# EAGLE design PlugEVSE_2x20A (EAGLE 8.6.0)
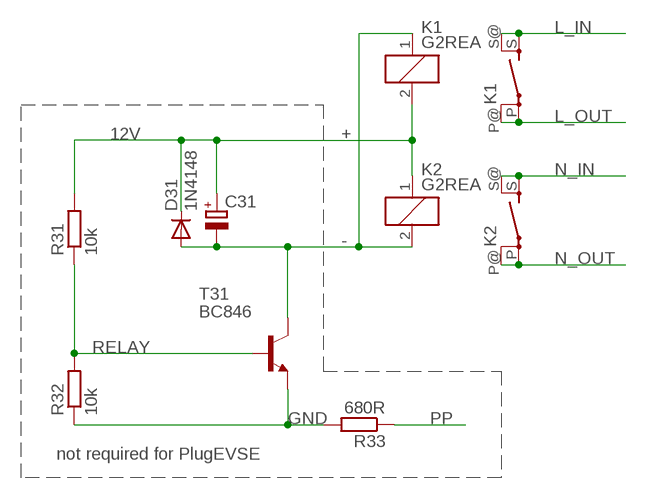
[diagram p0: schematic, sheet 1]

## Parts
C31  CPOL-EUSMCC  [SMC_C]
D31  1N4148  DIODE-SOD123  [SOD123]
K1  G2REA  [G2REA]
K2  G2REA  [G2REA]
R31  10k  R-EU_R0603  [R0603]
R32  10k  R-EU_R0603  [R0603]
R33  680R  R-EU_R2512  [R2512]
T31  BC846  [SOT23]

## Nets
12V: C31.+ D31.C K1.2 K2.1 R31.2
GND: R32.1 R33.2 T31.2(E)
L_IN: K1.S(2:S) K1.S@(2:S)
L_OUT: K1.P(2:P) K1.P@(2:P)
N_IN: K2.S(2:S) K2.S@(2:S)
N_OUT: K2.P(2:P) K2.P@(2:P)
PP: R33.1
RELAY: R31.1 R32.2 T31.1(B)
RL: C31.- D31.A K1.1 K2.2 T31.3(C)

## Notes on the sheet
- +
- -
- not required for PlugEVSE

## Library data of the parts
C31 = rcl:CPOL-EU: POLARIZED CAPACITOR, European symbol; SPICEPREFIX: C
D31 = diode:DIODE-: DIODE
K1 K2 = relay:G2REA: RELAY 1 x norm. open, high current, Omron; OC_FARNELL: unknown; OC_NEWARK: unknown
R31 R32 = rcl:R-EU_: RESISTOR, European symbol; SPICEPREFIX: R
R33 = rcl:R-EU_: RESISTOR, European symbol
T31 = transistor:BC846: NPN TRANSISTOR

## Board
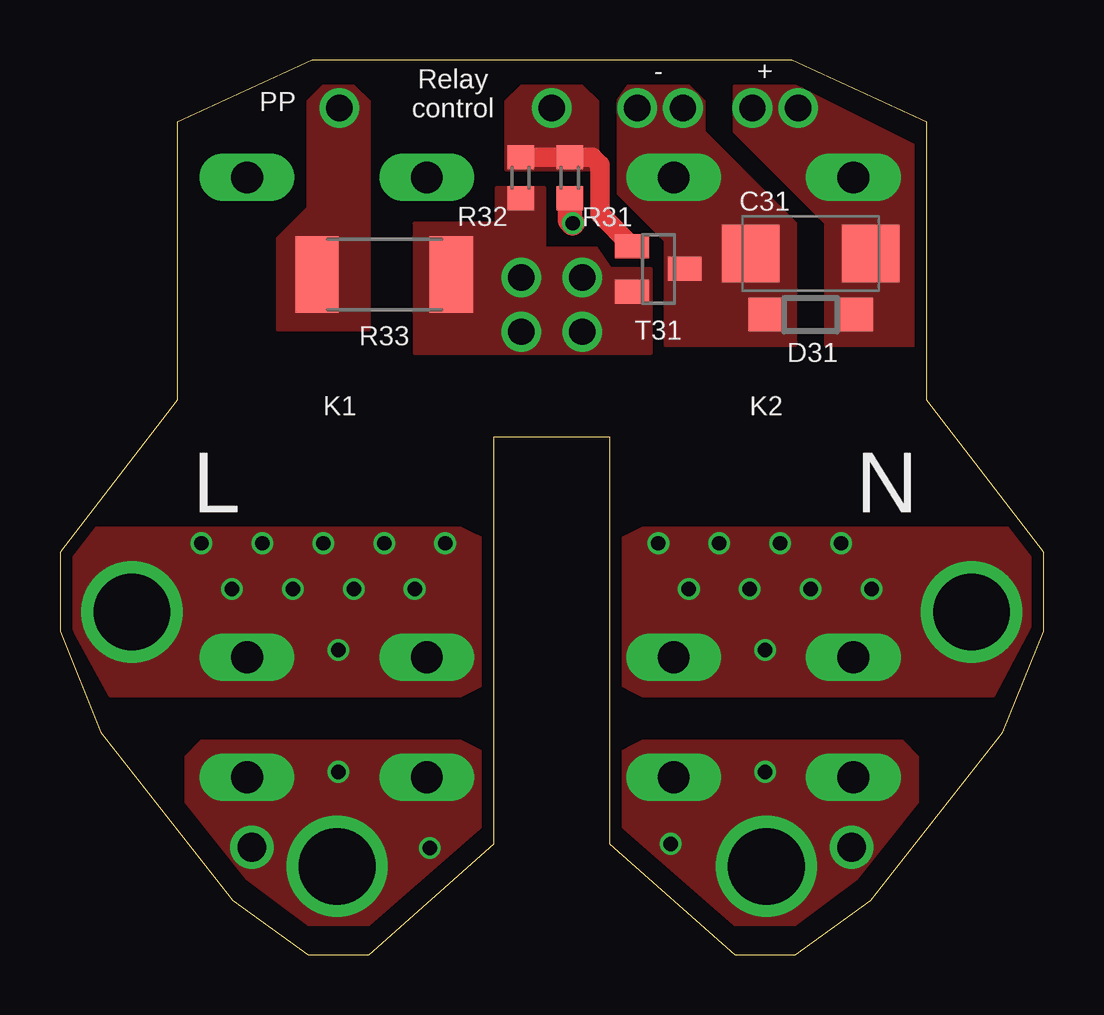
[diagram p1: board, top side]
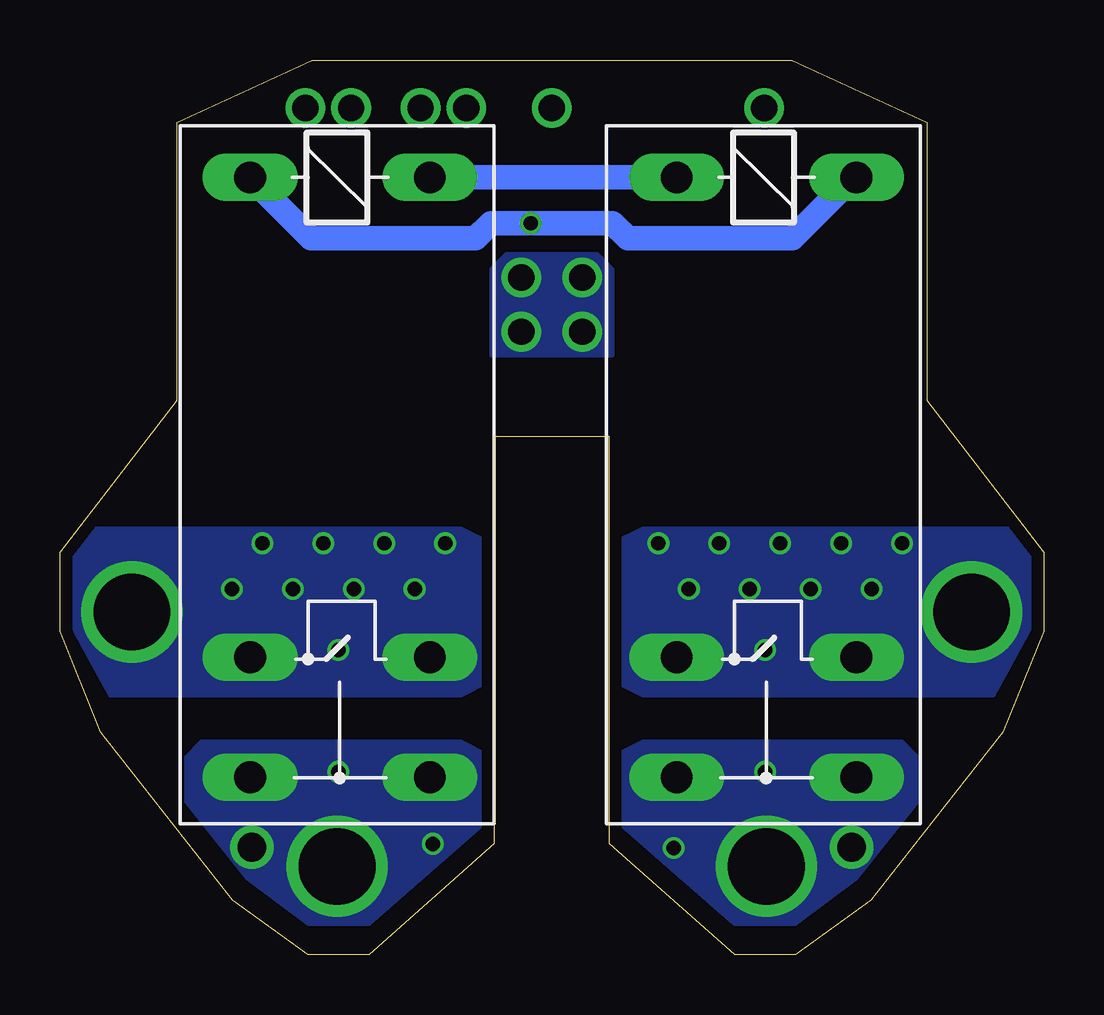
[diagram p2: board, bottom side, seen from below]

Size 41 x 37.28 mm. Coordinates in mm from the lower left corner, seen from the top.
Outline: 1.7,9.28 7.2,2.28 10.34,0 12.88,0 18.1,4.63 18.1,21.59 22.9,21.59 22.9,4.63 28.12,0 30.66,0 33.8,2.28 39.3,9.28 41,13.48 41,16.78 36.12,23.11 36.12,34.69 30.5,37.28 10.5,37.28 4.88,34.69 4.88,23.11 0,16.78 0,13.48 1.7,9.28
Copper layers (1*16): Top 0.035mm / dielectric 1.6mm / Bottom 0.035mm
Design rules "Elecrow_2-layer_PCB_eagle_rule": minimum track width 6mil, minimum drill 12mil, track to track 6mil, track to pad 6mil, pad to pad 6mil, via to via 8mil, smd to smd 0mil, copper to edge 20mil, drill to drill 10mil, minimum pad ring 6mil, minimum via ring 6mil, stop-mask expansion 0mil, vias tented up to drill 100mil, thermal gap 10mil

### Footprints (pad centres in the part's own frame; a part is rotated, then mirrored left to right if it is on the bottom)
SMC_C = smd 2.4 x 2.4: + -2.5,0; - 2.5,0
SOD123 = smd 1.4 x 1.4: A 1.9,0; C -1.9,0
G2REA = drill 1.321 long: 1 -2.54,-3.683; 2 -2.54,3.81; P 17.45,-3.683; P@ 17.45,3.81; S 22.454,-3.683; S@ 22.454,3.81
R0603 = smd 1 x 1.1: 1 -0.85,0; 2 0.85,0
R2512 = smd 1.8 x 3.2: 1 -2.8,0; 2 2.8,0
SOT23 = smd 1 x 1.4: 1 -0.95,-1.1; 2 0.95,-1.1; 3 0,1.1

### Placement (x,y rotation side)
C31  31.3,29.21 180 top
D31  31.3,26.67 180 top
K1  11.61,29.84 270 bottom
K2  29.39,29.84 270 bottom
R31  21.25,32.38 270 top
R32  19.2,32.38 90 top
R33  13.52,28.34 0 top
T31  24.95,28.58 270 top

### Tracks (layer width: path | path; a pad name or v marks a point on that pad's centre or on a via)
12V  (via drill 0.6, 1.1)
  Top 1.016: R31.2 21.25,30.6 v21.37,30.48
  Bottom 1.016: K2.1 30.53,29.84 23.68,29.84 23.04,30.48 v21.37,30.48 17.96,30.48 17.32,29.84 10.47,29.84 7.93,32.39 K1.2
  other vias: 28.87,35.28 30.77,35.28
  pour Top (no thermals): 28.12,36.2 28.12,34.29 31.93,30.48 31.93,25.4 35.74,25.4 35.74,33.66 30.66,36.2
GND  (via drill 1.1, 1.1 pad 1.3)
  other vias: 19.23,25.96 21.77,25.96 19.23,28.22 21.77,28.22
  pour Top (no thermals): 14.79,30.48 14.79,25.07 24.64,25.07 24.64,28.58 22.94,28.58 22.37,29.45 20.2,29.45 20.2,31.95 18.2,31.95 18.2,30.48
  pour Bottom: 17.96,24.96 17.96,28.58 18.59,29.21 22.41,29.21 23.04,28.58 23.04,24.96
L_IN  (via drill 0.6, 1.2, 3.2)
  other vias: 11.55,3.68 8,4.48 15.42,4.45 11.61,7.62
  pour Bottom (no thermals): 17.96,8.26 16.69,8.89 5.89,8.89 5.26,8.26 5.26,6.35 7.8,3.18 10.34,1.27 12.88,1.27 17.96,5.72
  pour Top (no thermals): 17.96,8.26 16.69,8.89 5.89,8.89 5.26,8.26 5.26,6.35 7.8,3.18 10.34,1.27 12.88,1.27 17.96,5.72
L_OUT  (via drill 0.6, 3.2)
  other vias: 3,14.28 16.05,17.14 13.52,17.14 10.97,17.14 8.44,17.14 5.89,17.14 7.16,15.24 9.71,15.24 12.24,15.24 14.79,15.24 11.61,12.7
  pour Top (no thermals): 1.45,17.78 16.69,17.78 17.96,17.14 17.96,11.43 16.69,10.8 2.09,10.8 0.58,13.57 0.58,16.64
  pour Bottom (no thermals): 17.96,17.14 17.96,11.43 16.69,10.8 2.09,10.8 0.58,13.57 0.58,16.64 1.45,17.78 16.69,17.78
N_IN  (via drill 0.6, 1.2, 3.2)
  other vias: 29.45,3.68 33,4.48 29.39,7.62 25.46,4.62
  pour Top (no thermals): 23.04,8.26 24.31,8.89 35.11,8.89 35.74,8.26 35.74,6.35 33.2,3.18 30.66,1.27 28.12,1.27 23.04,5.72
  pour Bottom (no thermals): 24.31,8.89 23.04,8.26 23.04,5.72 28.12,1.27 30.66,1.27 33.2,3.18 35.74,6.35 35.74,8.26 35.11,8.89
N_OUT  (via drill 0.6, 3.2)
  other vias: 38,14.28 32.56,17.14 31.3,15.24 30.02,17.14 27.48,17.14 24.95,17.14 26.21,15.24 28.76,15.24 33.84,15.24 29.39,12.7
  pour Top (no thermals): 24.31,17.78 23.04,17.14 23.04,11.43 24.31,10.8 38.91,10.8 40.42,13.67 40.42,16.61 39.55,17.78
  pour Bottom (no thermals): 24.31,17.78 39.55,17.78 40.42,16.61 40.42,13.57 38.91,10.8 24.31,10.8 23.04,11.43 23.04,17.14
PP  (via drill 1.1)
  other vias: 11.65,35.28
  pour Top (no thermals): 10.34,35.56 10.97,36.2 12.24,36.2 12.88,35.56 12.88,26.04 9.07,26.04 9.07,29.84 10.34,31.12
RELAY  (via drill 1.1)
  Top 0.61: 21.13,33.22 R32.2
  Top 0.813: T31.1 22.5,30.87 22.5,32.92 22.2,33.22 21.13,33.22 | R32.2 21.14,33.23
  other vias: 20.5,35.28
  pour Top (no thermals): 18.59,35.56 18.59,32.72 22.41,32.69 22.41,35.56 21.77,36.2 19.23,36.2
RL  (via drill 1.1)
  Bottom 1.016: K1.1 K2.2
  other vias: 25.97,35.28 24.07,35.28
  pour Top (no thermals): 23.68,36.2 23.27,35.62 23.27,31.72 25.25,29.75 25.25,25.4 30.66,25.4 30.66,30.48 26.85,34.29 26.85,35.56 26.21,36.2

### Text on the board
tNames: - | + | PP | Relay / control | L | N